# EAGLE schematic conduct1 (EAGLE 6.5.0)
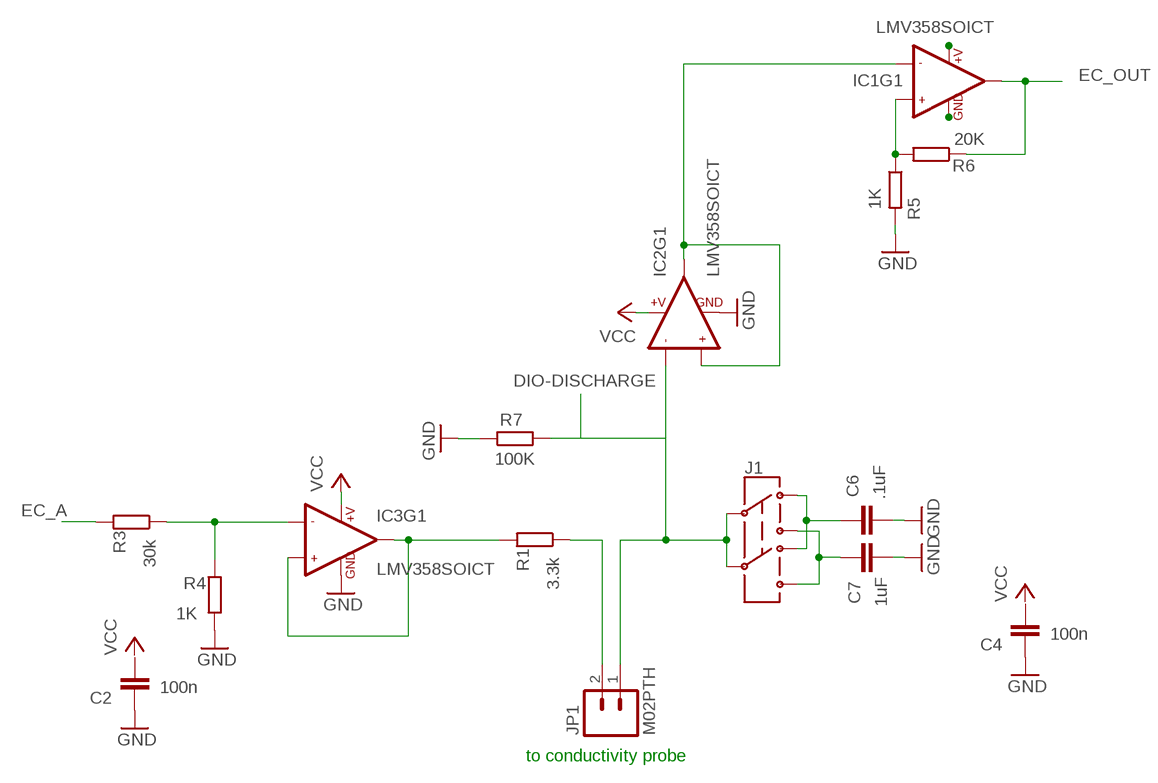
[diagram p0: schematic, sheet 1]

## Parts
C2  100n  C-EUC0805  [C0805]
C4  100n  C-EUC0805  [C0805]
C6  .1uF  C-EUC0805  [C0805]
C7  1uF  C-EUC0805  [C0805]
IC1  LMV358SOICT  [SO08-TIGHT]
IC2  LMV358SOICT  [SO08-TIGHT]
IC3  LMV358SOICT  [SO08-TIGHT]
J1  AYZ0202  [AYZ0202]
JP1  M02PTH  [1X02]
R1  3.3k  R-EU_R0805  [R0805]
R3  30k  R-EU_R0805  [R0805]
R4  1K  R-EU_R0805  [R0805]
R5  1K  R-EU_R0805  [R0805]
R6  20K  R-EU_R0805  [R0805]
R7  100K  R-EU_R0805  [R0805]

## Nets
DIO-DISCHARGE: IC2.2(-IN1) J1.2 J1.5 R7.2
EC_A: R3.2
EC_OUT: IC1.1(OUT1) R6.1
GND: C2.1 C4.1 C6.2 C7.2 IC2.4(GND) IC3.4(GND) R4.1 R5.2 R7.1
N$1: IC3.2(-IN1) R3.1 R4.2
N$2: IC3.1(OUT1) IC3.3(+IN1) R1.2
N$3: IC1.3(+IN1) R5.1 R6.2
N$5: JP1.1 JP1.2 R1.1
N$6: C6.1 J1.3 J1.6
N$8: IC1.8(+V)
N$9: IC1.4(GND)
N$12: IC1.2(-IN1) IC2.1(OUT1) IC2.3(+IN1)
VCC: IC2.8(+V) IC3.8(+V)
VDD1: C7.1 J1.1 J1.4
Unconnected: C2.2 C4.2 IC1.5(+IN2) IC1.6(-IN2) IC1.7(OUT2) IC2.5(+IN2) IC2.6(-IN2) IC2.7(OUT2) IC3.5(+IN2) IC3.6(-IN2) IC3.7(OUT2)

## Notes on the sheet
- to conductivity probe

## Library data of the parts
C2 C4 C6 C7 = resistor:C-EU: CAPACITOR, European symbol
IC1-IC3 = SparkFun-AnalogIC:LMV358: Jellybean rail-to-rail output op-amp; PROD_ID: IC-09657
J1 = SparkFunNew:AYZ0202: SPDT Slide Switch Simple SMD single-pull double-throw slide switch. Good for less than 350mA power switch, switching UARTs between devices, etc. Spark Fun Electronics SKU : COM-00597
JP1 = SparkFun-Connectors:M02: Standard 2-pin 0.1" header. Use with - straight break away headers ( PRT-00116) - right angle break away headers (PRT-00553) - swiss pins (PRT-00743) - machine pins (PRT-00117) - female headers (PRT-00115) Molex polarized connector foot print use with: PRT-08233 with associated crimp pins and housings. 2.54_SCREWTERM for use with PRT-10571. 3.5mm Screw Terminal footprints for PRT-08084 5mm Screw Terminal footprints for use with PRT-08433
R1 R3-R7 = rcl:R-EU_: RESISTOR, European symbol

## Net classes
0 default: width 0.254 mm, clearance 0.203 mm